# Altium project DAL_PDU.PrjPcb
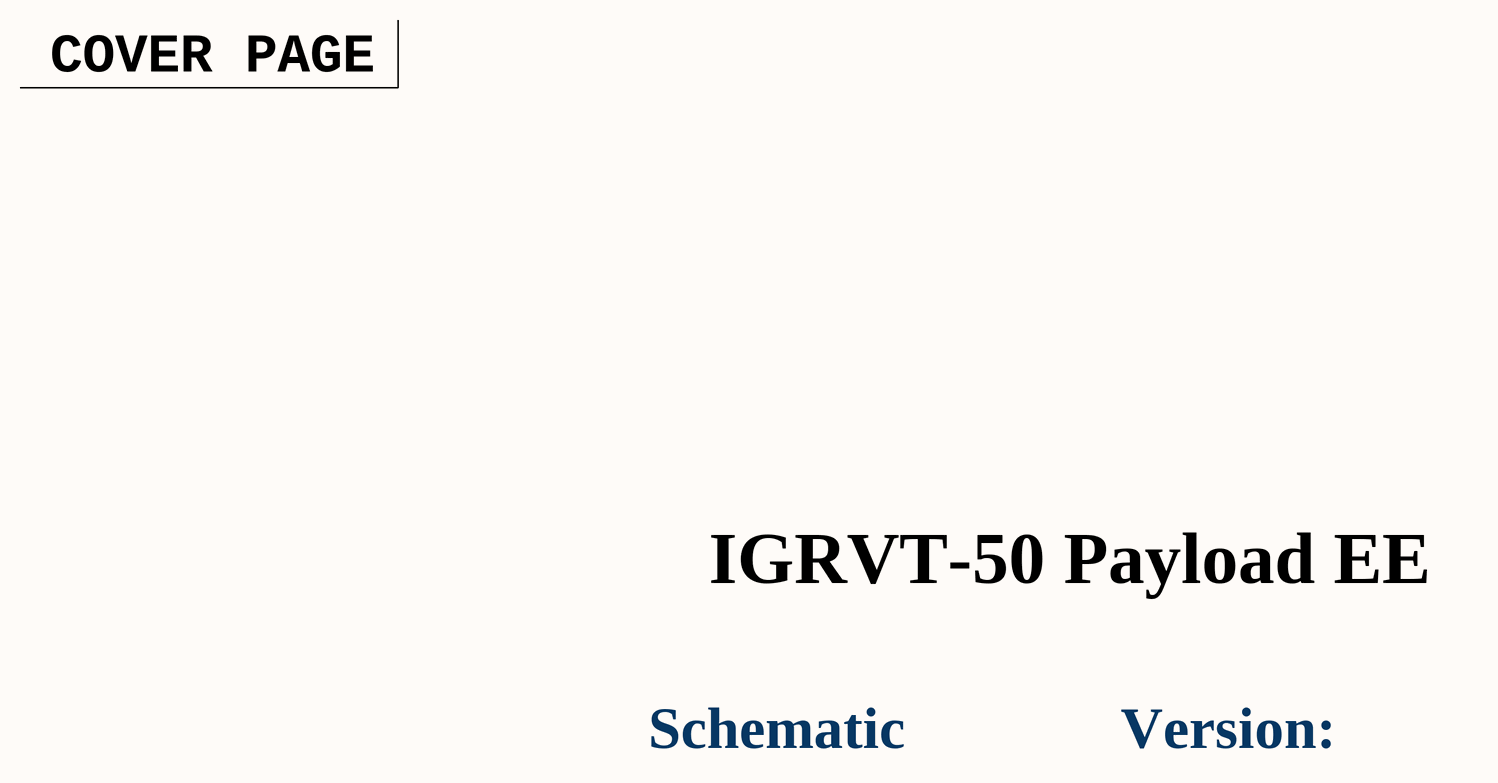
[diagram p0: CoverPage.SchDoc]
15 sheets, 248 parts. Net scope: global (net labels, ports and power ports of the same name join across sheets).
Board file: DAL_DPU.PcbDoc
Sheets:
  CoverPage.SchDoc
  Connectors.SchDoc
  PowerMonitor.SchDoc
  eFuse.SchDoc
  Buck 5V.SchDoc
  Buck 5-12V.SchDoc
  MCU.SchDoc
  CAN.SchDoc
  RS485.SchDoc
  TemperatureSensor.SchDoc
  RS232.SchDoc
  WatchDog.SchDoc
  I2C.SchDoc
  LED.SchDoc
  Mounting Holes.SchDoc

## Sheet CoverPage.SchDoc
size 420 x 297 mm; Revision: 1.1.0; SheetNumber: 1; SheetTotal: 15

### Notes on the sheet
- COVER PAGE
- IGRVT-50 Payload EE
- Schematic
- Version:
- Project:
- DAL_PDU
- Sub-system:
- IGRVT-50
- Design by:
- KIEN HOANG
- BAO BUI
- Sheet title:
- Sheet
- A3
- of
- Checked by:
- Approved by:
- VU PHAM
- Revision:
- Document No:
- Size:
- Date:

## Sheet Connectors.SchDoc
size 420 x 297 mm; Revision: 1.1.0; SheetNumber: 2; SheetTotal: 15
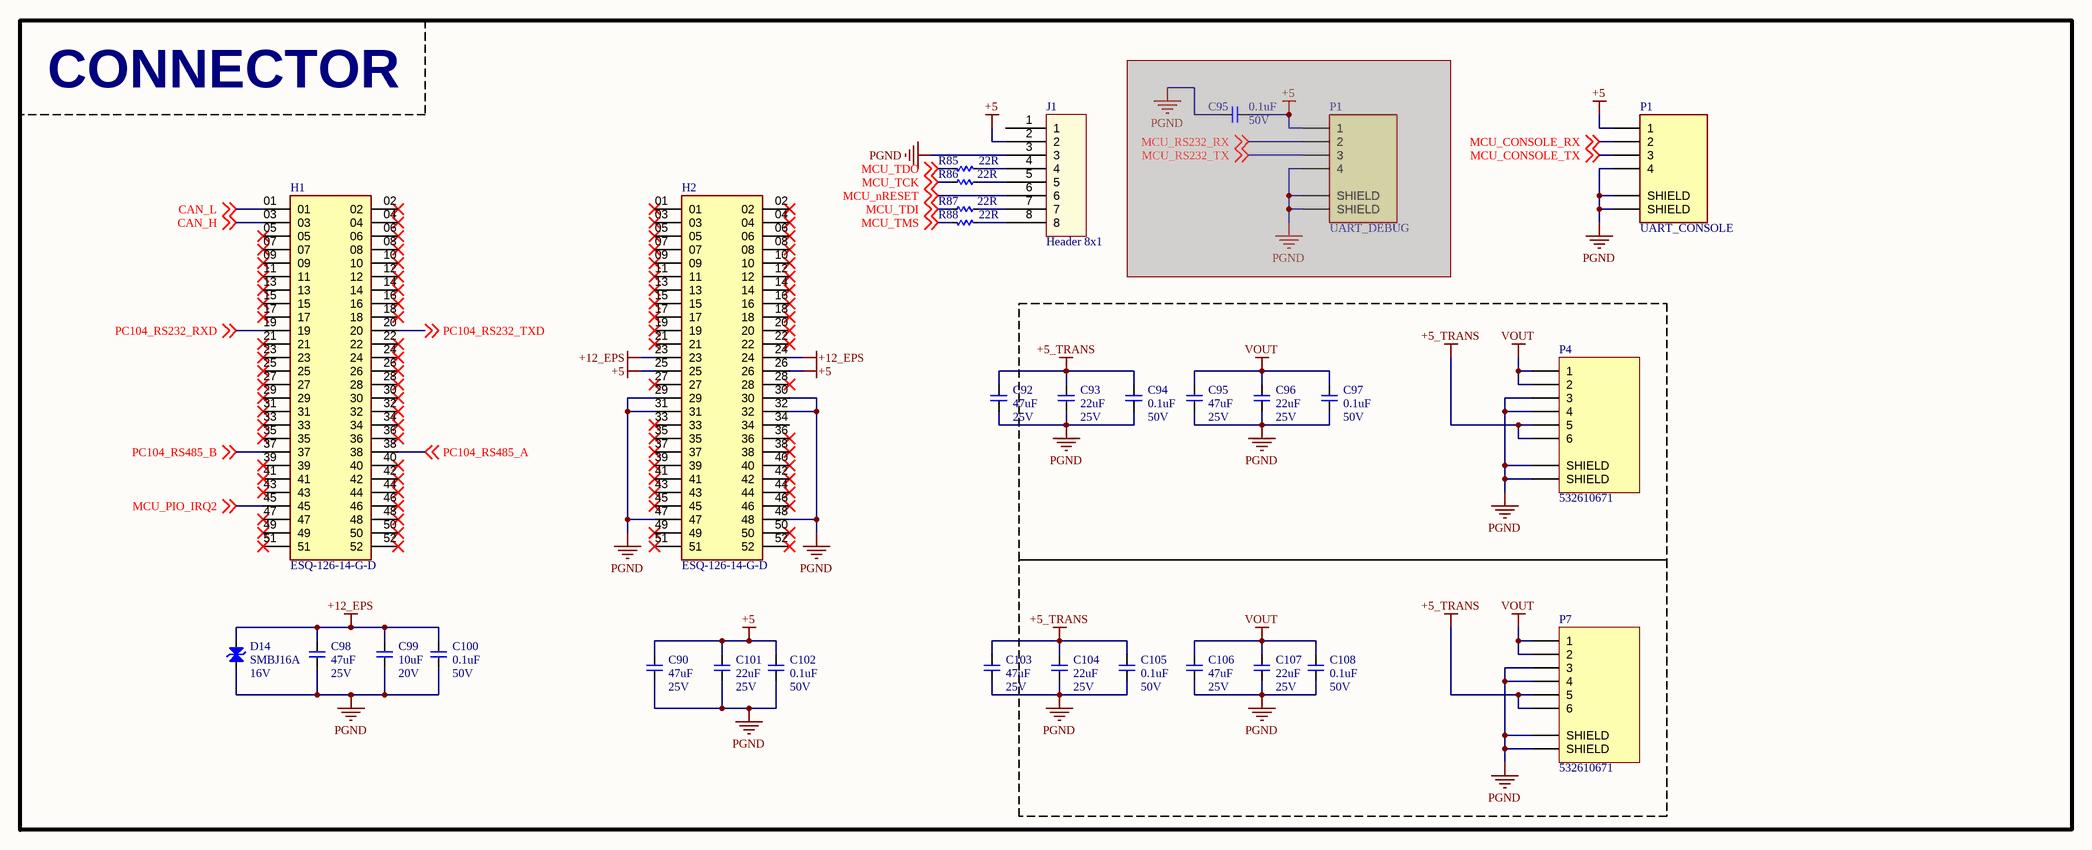
[diagram p1: Connectors.SchDoc]

### Parts
(Parts that share a designator on the sheet are numbered #1, #2 ... from top to bottom, then left to right.)
C90  47uF  Voltage: 25V  [CAP_C_3225X80]
C92  47uF  Voltage: 25V  [CAP_C_3225X80]
C93  22uF  Voltage: 25V  [CAP_C_2012X110]
C94  0.1uF  Voltage: 50V  [CAP_C_1608X80]
C95#1  0.1uF  Voltage: 50V  [CAP_C_1608X80]  (masked out: inside a compile mask, not in the netlist)
C95#2  47uF  Voltage: 25V  [CAP_C_3225X80]
C96  22uF  Voltage: 25V  [CAP_C_2012X110]
C97  0.1uF  Voltage: 50V  [CAP_C_1608X80]
C98  47uF  Voltage: 25V  [CAP_C_3225X80]
C99  10uF  Voltage: 20V  [CAP_C_2012X110]
C100  0.1uF  Voltage: 50V  [CAP_C_1608X80]
C101  22uF  Voltage: 25V  [CAP_C_2012X110]
C102  0.1uF  Voltage: 50V  [CAP_C_1608X80]
C103  47uF  Voltage: 25V  [CAP_C_3225X80]
C104  22uF  Voltage: 25V  [CAP_C_2012X110]
C105  0.1uF  Voltage: 50V  [CAP_C_1608X80]
C106  47uF  Voltage: 25V  [CAP_C_3225X80]
C107  22uF  Voltage: 25V  [CAP_C_2012X110]
C108  0.1uF  Voltage: 50V  [CAP_C_1608X80]
D14  SMBJ16A  Voltage: 16V  [DO-214AA_SMB]
H1  ESQ-126-14-G-D  [ESQ-126-14-G-D]
H2  ESQ-126-14-G-D  [ESQ-126-14-G-D]
J1  Header 8x1  [Header_254P_8x1]
P1#1  UART_DEBUG  [0532610471]  (masked out: inside a compile mask, not in the netlist)
P1#2  UART_CONSOLE  [0532610471]
P4  532610671  [532610671]
P7  532610671  [532610671]
R85  22R  [RES_C_1608X60]
R86  22R  [RES_C_1608X60]
R87  22R  [RES_C_1608X60]
R88  22R  [RES_C_1608X60]

### Blocks framed on the sheet
CONNECTOR: C90 C92-C94 C95#1 C95#2 C96-C108 D14 H1 H2 J1 P1#1 P1#2 P4 P7 R85-R88

### Nets
+5: C90.2 C101.2 C102.2 H2.25 H2.26 J1.2 P1#2.1
+5_TRANS: C92.2 C93.2 C94.2 C103.2 C104.2 C105.2 P4.5 P4.6 P7.5 P7.6
+12_EPS: C98.2 C99.2 C100.2 D14.1(A) H2.23 H2.24
PGND: C90.1 C92.1 C93.1 C94.1 C95#2.1 C96.1 C97.1 C98.1 C99.1 C100.1 C101.1 C102.1 C103.1 C104.1 C105.1 C106.1 C107.1 C108.1 D14.2(K) H2.29 H2.30 H2.31 H2.32 H2.47 H2.48 J1.3 P1#2.4 P1#2.S1(SHIELD) P1#2.S2(SHIELD) P4.3 P4.4 P4.S1(SHIELD) P4.S2(SHIELD) P7.3 P7.4 P7.S1(SHIELD) P7.S2(SHIELD)
VOUT: C95#2.2 C96.2 C97.2 C106.2 C107.2 C108.2 P4.1 P4.2 P7.1 P7.2
CAN_H: H1.03 ; off-sheet CAN_H
CAN_L: H1.01 ; off-sheet CAN_L
MCU_CONSOLE_RX: P1#2.2 ; off-sheet MCU_CONSOLE_RX
MCU_CONSOLE_TX: P1#2.3 ; off-sheet MCU_CONSOLE_TX
MCU_nRESET: J1.6 ; off-sheet MCU_nRESET
MCU_PIO_IRQ2: H1.45 ; off-sheet MCU_PIO_IRQ2
MCU_TCK: R86.1 ; off-sheet MCU_TCK
MCU_TDI: R87.1 ; off-sheet MCU_TDI
MCU_TDO: R85.2 ; off-sheet MCU_TDO
MCU_TMS: R88.1 ; off-sheet MCU_TMS
PC104_RS232_RXD: H1.19 ; off-sheet PC104_RS232_RXD
PC104_RS232_TXD: H1.20 ; off-sheet PC104_RS232_TXD
PC104_RS485_A: H1.38 ; off-sheet PC104_RS485_A
PC104_RS485_B: H1.37 ; off-sheet PC104_RS485_B
NetJ1_4: J1.4 R85.1
NetJ1_5: J1.5 R86.2
NetJ1_7: J1.7 R87.2
NetJ1_8: J1.8 R88.2

Not connected (* = marked no-connect by the designer): H1 02* 04* 05* 06* 07* 08* 09* 10* 11* 12* 13* 14* 15* 16* 17* 18* 21* 22* 23* 24* 25* 26* 27* 28* 29* 30* 31* 32* 33* 34* 35* 36* 39* 40* 41* 42* 43* 44* 46* 47* 48* 49* 50* 51* 52*; H2 01* 02* 03* 04* 05* 06* 07* 08* 09* 10* 11* 12* 13* 14* 15* 16* 17* 18* 19* 20* 21* 22* 27* 28* 33* 34 35* 36* 37* 38* 39* 40* 41* 42* 43* 44* 45* 46* 49* 50* 51* 52*; J1 1

### Notes on the sheet
- Project:
- DAL_PDU
- Sub-system:
- IGRVT-50
- Design by:
- KIEN HOANG
- BAO BUI
- Sheet title:
- Sheet
- A3
- of
- Checked by:
- Approved by:
- VU PHAM
- Revision:
- Document No:
- Size:
- Date:

### Library data of the parts
C90 C92-C94 C95#1 C95#2 C96-C108 = _CAP_C_2: CAP
D14 = Diode TVS: TVS Diode; Code - JEDEC: DO-214-AB; Value: 1N5007; Published: 8-Jun-2000; Revision: July-2002: Re-released for DXP Platform.; Publisher: Altium Limited
P1#1 P1#2 = 0532610471
R85-R88 = _RES_B_2_2: RES

## Sheet PowerMonitor.SchDoc
size 420 x 297 mm; Revision: 1.1.0; SheetNumber: 3; SheetTotal: 15
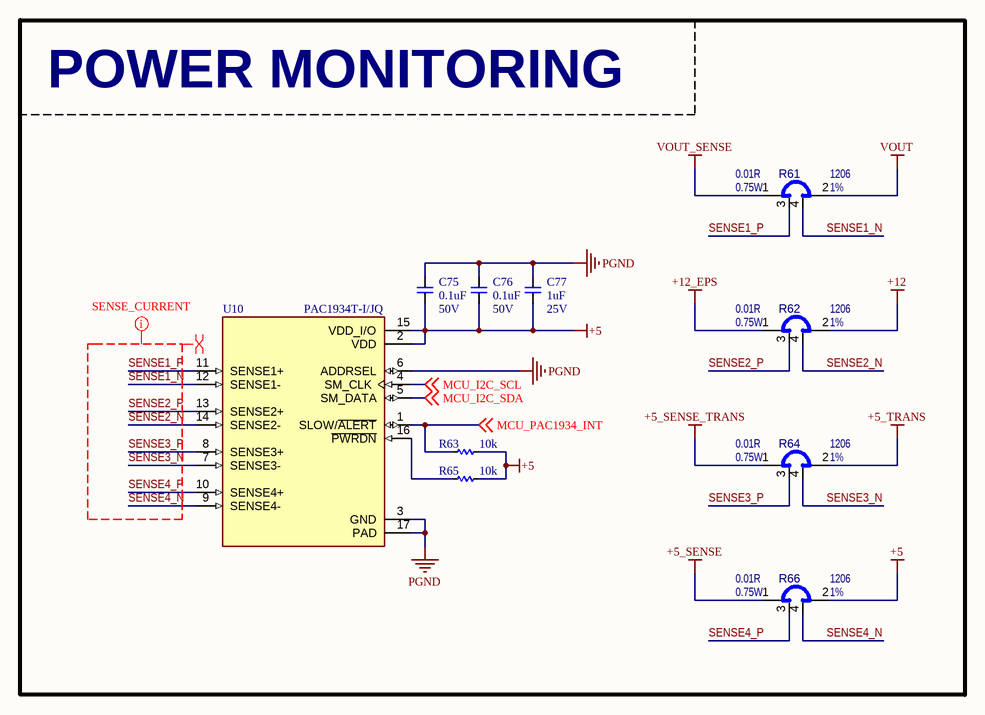
[diagram p2: PowerMonitor.SchDoc]

### Parts
C75  0.1uF  Voltage: 50V  [CAP_C_1608X80]
C76  0.1uF  Voltage: 50V  [CAP_C_1608X80]
C77  1uF  Voltage: 25V  [CAP_C_1608X80]
R61  value 0.01R  Package: 1206  Tolerance: 1%  Power: 0.75W  [RES_C_1206_SHUNT]  (hidden comment: Shunt 4 Pin)
R62  value 0.01R  Package: 1206  Tolerance: 1%  Power: 0.75W  [RES_C_1206_SHUNT]  (hidden comment: Shunt 4 Pin)
R63  10k  [RES_C_1608X60]
R64  value 0.01R  Package: 1206  Tolerance: 1%  Power: 0.75W  [RES_C_1206_SHUNT]  (hidden comment: Shunt 4 Pin)
R65  10k  [RES_C_1608X60]
R66  value 0.01R  Package: 1206  Tolerance: 1%  Power: 0.75W  [RES_C_1206_SHUNT]  (hidden comment: Shunt 4 Pin)
U10  PAC1934T-I/JQ  [QFN65]

### Blocks framed on the sheet
POWER MONITORING: C75-C77 R61-R66 U10

### Nets
+5: C75.2 C76.2 C77.2 R63.1 R65.2 R66.2 U10.2(VDD) U10.15(VDD_I/O)
+5_SENSE: R66.1
+5_SENSE_TRANS: R64.1
+5_TRANS: R64.2
+12: R62.2
+12_EPS: R62.1
PGND: C75.1 C76.1 C77.1 U10.3(GND) U10.6(ADDRSEL) U10.17(PAD)
VOUT: R61.2
VOUT_SENSE: R61.1
MCU_I2C_SCL: U10.4(SM_CLK) ; off-sheet MCU_I2C_SCL
MCU_I2C_SDA: U10.5(SM_DATA) ; off-sheet MCU_I2C_SDA
MCU_PAC1934_INT: R63.2 U10.1(SLOW/~{ALERT}) ; off-sheet MCU_PAC1934_INT
SENSE1_N: R61.4 U10.12(SENSE1-)
SENSE1_P: R61.3 U10.11(SENSE1+)
SENSE2_N: R62.4 U10.14(SENSE2-)
SENSE2_P: R62.3 U10.13(SENSE2+)
SENSE3_N: R64.4 U10.7(SENSE3-)
SENSE3_P: R64.3 U10.8(SENSE3+)
SENSE4_N: R66.4 U10.9(SENSE4-)
SENSE4_P: R66.3 U10.10(SENSE4+)
NetR65_1: R65.1 U10.16(~{PWRDN})

### Layout directives
differential pair: SENSE1_N, SENSE1_P, SENSE2_N, SENSE2_P, SENSE3_N, SENSE3_P, SENSE4_N, SENSE4_P
net class SENSE_CURRENT: SENSE1_N, SENSE1_P, SENSE2_N, SENSE2_P, SENSE3_N, SENSE3_P, SENSE4_N, SENSE4_P

### Notes on the sheet
- Project:
- DAL_PDU
- Sub-system:
- IGRVT-50
- Design by:
- KIEN HOANG
- BAO BUI
- Sheet title:
- Sheet
- A3
- of
- Checked by:
- Approved by:
- VU PHAM
- Revision:
- Document No:
- Size:
- Date:

### Library data of the parts
C75-C77 = _CAP_C_2: CAP
R61 R62 R64 R66 = RSMT1316: Shunt; Manufacturer 1: SUSUMU; Manufacturer Part Number 1: KRL1632E-M-R010-F-T5; Description_: RES SHUNT MF 0.01R 1% 0.75W SMD 1206; Dev Tools Status: Design; Temperature Coeffcient: 50ppm/C; Current: 8A; Owner: Ciprian Abramov; Populated: YES; MCHP-ID: RSMT1316; Revision: 1; Symbol: Shunt 4 Pin; Status: MCL Design; ComponentLink1URL: https://chn-vm-apps.microchip.com/mchprepo/parts/Datasheets/n_catalog_partition09_en.pdf; ComponentLink1Description: SVN Datasheet; ComponentLink2URL: C:\ALTIUM_WORK\00001_MCHP-CDB\Datasheets\n_catalog_partition09_en.pdf; ComponentLink2Description: Local Datasheet; ComponentLink3URL: C:\ALTIUM_WORK\00001_MCHP-CDB\Library\LibraryRefs\Shunt 4 Pin.SchLib; ComponentLink3Description: Open Symbol; ComponentLink4URL: C:\ALTIUM_WORK\00001_MCHP-CDB\Library\Footprints\RES_C_1206_SHUNT.PcbLib; ComponentLink4Description: Open Footprint; ComponentLink5Description: Open Footprint 2; ComponentLink6Description: Open Footprint 3; ComponentLink7Description: Open Footprint 4; Operating Temperature: -55C to +155C; Category: Resistor; Type: RES SMD; Composition: MF; Supplier 1: Digi-Key; Supplier Part Number 1: 408-1570-1-ND; Quantity Override: 1
R63 R65 = _RES_B_2_2: RES

## Sheet eFuse.SchDoc
size 420 x 297 mm; Revision: 1.1.0; SheetNumber: 4; SheetTotal: 15
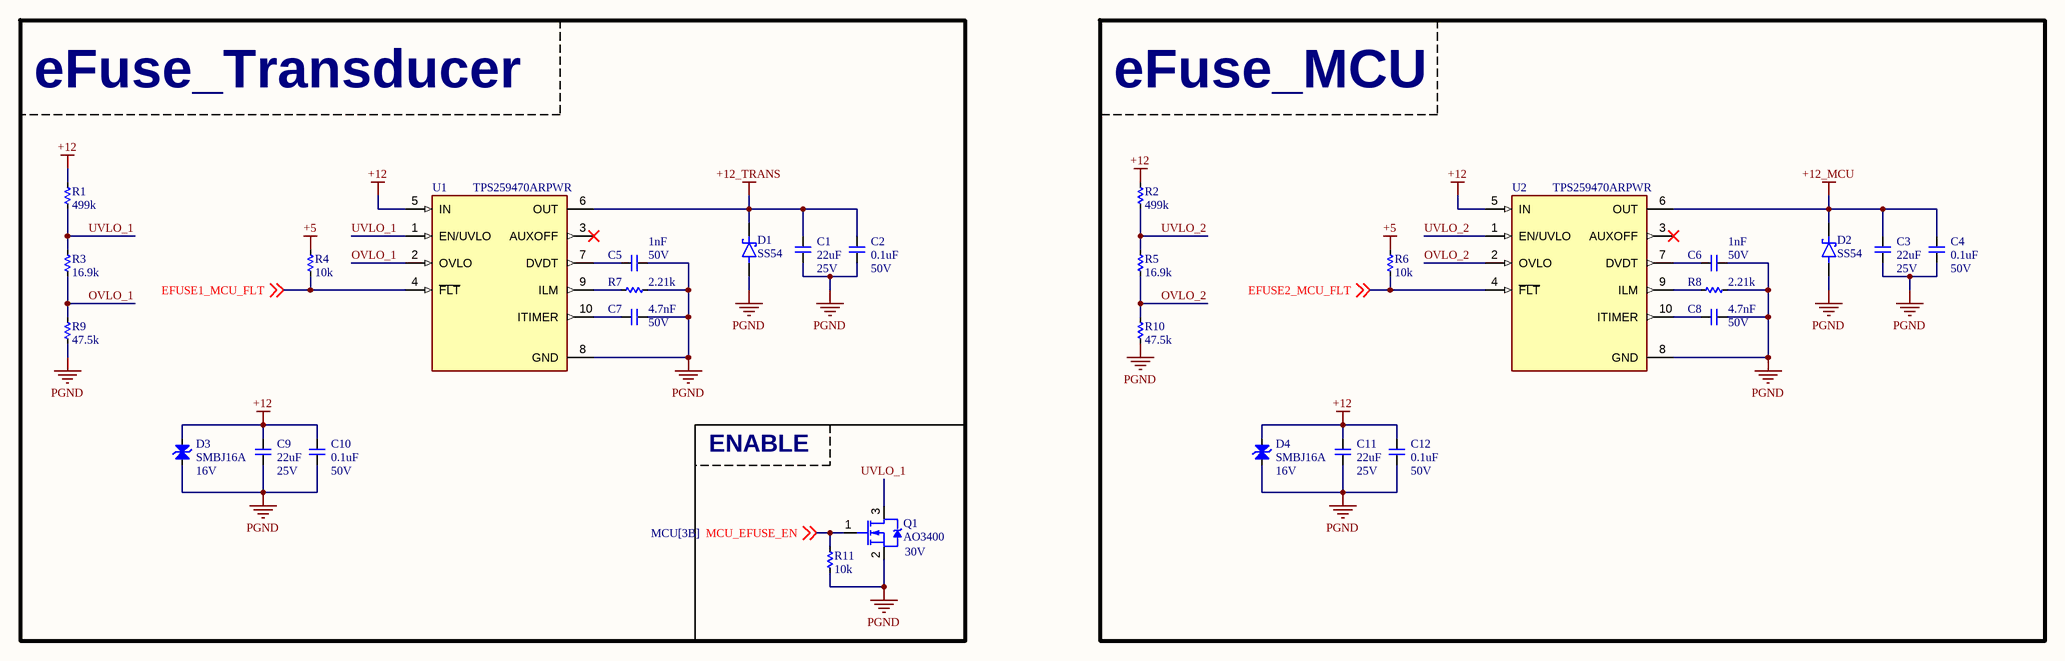
[diagram p3: eFuse.SchDoc]

### Parts
C1  22uF  Voltage: 25V  [CAP_C_2012X110]
C2  0.1uF  Voltage: 50V  [CAP_C_1608X80]
C3  22uF  Voltage: 25V  [CAP_C_2012X110]
C4  0.1uF  Voltage: 50V  [CAP_C_1608X80]
C5  1nF  Voltage: 50V  [CAP_C_1608X80]
C6  1nF  Voltage: 50V  [CAP_C_1608X80]
C7  4.7nF  Voltage: 50V  [CAP_C_1608X80]
C8  4.7nF  Voltage: 50V  [CAP_C_1608X80]
C9  22uF  Voltage: 25V  [CAP_C_2012X110]
C10  0.1uF  Voltage: 50V  [CAP_C_1608X80]
C11  22uF  Voltage: 25V  [CAP_C_2012X110]
C12  0.1uF  Voltage: 50V  [CAP_C_1608X80]
D1  SS54  [DO-214AC_SMA]
D2  SS54  [DO-214AC_SMA]
D3  SMBJ16A  Voltage: 16V  [DO-214AA_SMB]
D4  SMBJ16A  Voltage: 16V  [DO-214AA_SMB]
Q1  AO3400  Voltage: 30V  [SOT-23]
R1  499k  [RES_C_1608X60]
R2  499k  [RES_C_1608X60]
R3  16.9k  [RES_C_1608X60]
R4  10k  [RES_C_1608X60]
R5  16.9k  [RES_C_1608X60]
R6  10k  [RES_C_1608X60]
R7  2.21k  [RES_C_1608X60]
R8  2.21k  [RES_C_1608X60]
R9  47.5k  [RES_C_1608X60]
R10  47.5k  [RES_C_1608X60]
R11  10k  [RES_C_1608X60]
U1  TPS259470ARPWR  [TPS259474]
U2  TPS259470ARPWR  [TPS259474]

### Blocks framed on the sheet
eFuse_Transducer: C1 C2 C5 C7 C9 C10 D1 D3 Q1 R1 R3 R4 R7 R9 R11 U1
eFuse_MCU: C3 C4 C6 C8 C11 C12 D2 D4 R2 R5 R6 R8 R10 U2

### Nets
+5: R4.1 R6.1
+12: C9.2 C10.2 C11.2 C12.2 D3.1(A) D4.1(A) R1.2 R2.2 U1.5(IN) U2.5(IN)
+12_MCU: C3.2 C4.1 D2.1(K) U2.6(OUT)
+12_TRANS: C1.2 C2.1 D1.1(K) U1.6(OUT)
PGND: C1.1 C2.2 C3.1 C4.2 C5.2 C6.2 C7.2 C8.2 C9.1 C10.1 C11.1 C12.1 D1.2(A) D2.2(A) D3.2(K) D4.2(K) Q1.2(S) R7.2 R8.2 R9.1 R10.1 R11.2 U1.8(GND) U2.8(GND)
EFUSE1_MCU_FLT: R4.2 U1.4(~{FLT}) ; off-sheet EFUSE1_MCU_FLT
EFUSE2_MCU_FLT: R6.2 U2.4(~{FLT}) ; off-sheet EFUSE2_MCU_FLT
MCU_EFUSE_EN: Q1.1(G) R11.1 ; off-sheet MCU_EFUSE_EN
OVLO_1: R3.1 R9.2 U1.2(OVLO)
OVLO_2: R5.1 R10.2 U2.2(OVLO)
UVLO_1: Q1.3(D) R1.1 R3.2 U1.1(EN/UVLO)
UVLO_2: R2.1 R5.2 U2.1(EN/UVLO)
NetC5_1: C5.1 U1.7(DVDT)
NetC6_1: C6.1 U2.7(DVDT)
NetC7_1: C7.1 U1.10(ITIMER)
NetC8_1: C8.1 U2.10(ITIMER)
NetR7_1: R7.1 U1.9(ILM)
NetR8_1: R8.1 U2.9(ILM)

Not connected (* = marked no-connect by the designer): U1 3(AUXOFF)*; U2 3(AUXOFF)*

### Notes on the sheet
- ENABLE
- Project:
- DAL_PDU
- Sub-system:
- IGRVT-50
- Design by:
- KIEN HOANG
- BAO BUI
- Sheet title:
- Sheet
- A3
- of
- Checked by:
- Approved by:
- VU PHAM
- Revision:
- Document No:
- Size:
- Date:

### Library data of the parts
C1-C12 = _CAP_C_2: CAP
D1 D2 = DIODE SCHOTTKY
D3 D4 = Diode TVS: as D14 on sheet Connectors; Published: 8-Jun-2000; Revision: July-2002: Re-released for DXP Platform.; Publisher: Altium Limited
Q1 = Mosfet N
R1-R11 = _RES_B_2_2: RES

## Sheet Buck 5V.SchDoc
size 420 x 297 mm; Revision: 1.0.0; SheetNumber: 5; SheetTotal: 15
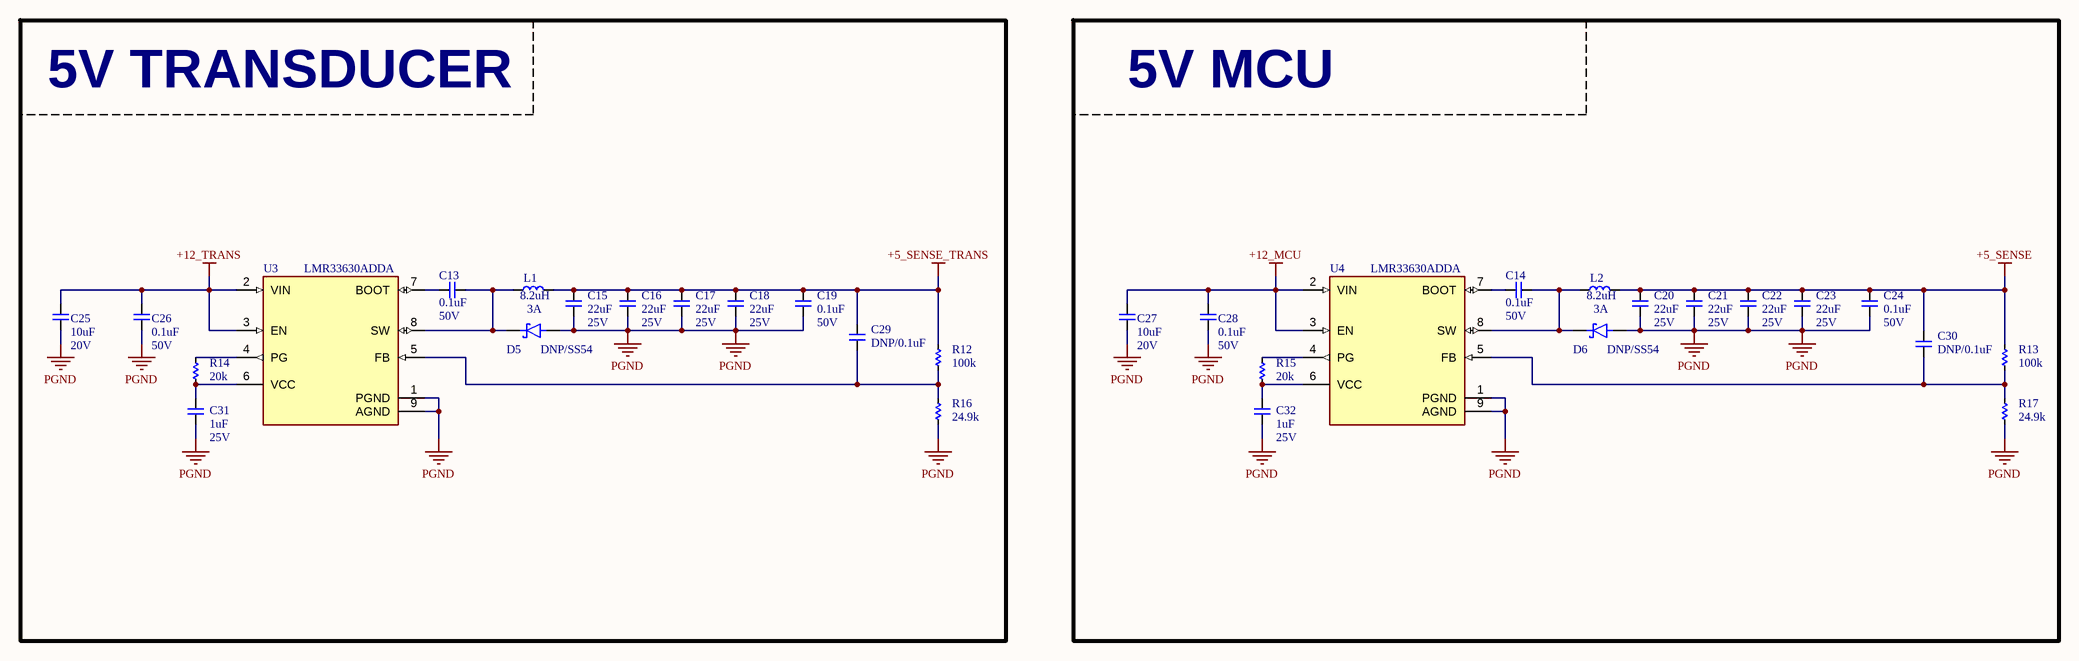
[diagram p4: Buck 5V.SchDoc]

### Parts
C13  0.1uF  Voltage: 50V  [CAP_C_1608X80]
C14  0.1uF  Voltage: 50V  [CAP_C_1608X80]
C15  22uF  Voltage: 25V  [CAP_C_2012X110]
C16  22uF  Voltage: 25V  [CAP_C_2012X110]
C17  22uF  Voltage: 25V  [CAP_C_2012X110]
C18  22uF  Voltage: 25V  [CAP_C_2012X110]
C19  0.1uF  Voltage: 50V  [CAP_C_1608X80]
C20  22uF  Voltage: 25V  [CAP_C_2012X110]
C21  22uF  Voltage: 25V  [CAP_C_2012X110]
C22  22uF  Voltage: 25V  [CAP_C_2012X110]
C23  22uF  Voltage: 25V  [CAP_C_2012X110]
C24  0.1uF  Voltage: 50V  [CAP_C_1608X80]
C25  10uF  Voltage: 20V  [CAP_C_2012X110]
C26  0.1uF  Voltage: 50V  [CAP_C_1608X80]
C27  10uF  Voltage: 20V  [CAP_C_2012X110]
C28  0.1uF  Voltage: 50V  [CAP_C_1608X80]
C29  Voltage: DNP/0.1uF  [CAP_C_1608X80]  (hidden comment: DNP/100nF)
C30  Voltage: DNP/0.1uF  [CAP_C_1608X80]  (hidden comment: DNP/100nF)
C31  1uF  Voltage: 25V  [CAP_C_1608X80]
C32  1uF  Voltage: 25V  [CAP_C_1608X80]
D5  DNP/SS54  [DO-214AC_SMA]
D6  DNP/SS54  [DO-214AC_SMA]
L1  8.2uH  Voltage: 3A  [INDUCTOR 6363]
L2  8.2uH  Voltage: 3A  [INDUCTOR 6363]
R12  100k  [RES_C_1608X60]
R13  100k  [RES_C_1608X60]
R14  20k  [RES_C_1608X60]
R15  20k  [RES_C_1608X60]
R16  24.9k  [RES_C_1608X60]
R17  24.9k  [RES_C_1608X60]
U3  LMR33630ADDA  [HSOIC_8]
U4  LMR33630ADDA  [HSOIC_8]

### Blocks framed on the sheet
5V TRANSDUCER: C13 C15-C19 C25 C26 C29 C31 D5 L1 R12 R14 R16 U3
5V MCU: C14 C20-C24 C27 C28 C30 C32 D6 L2 R13 R15 R17 U4

### Nets
+5_SENSE: C20.1 C21.1 C22.1 C23.1 C24.1 C30.1 L2.2 R13.1
+5_SENSE_TRANS: C15.1 C16.1 C17.1 C18.1 C19.1 C29.1 L1.2 R12.1
+12_MCU: C27.1 C28.1 U4.2(VIN) U4.3(EN)
+12_TRANS: C25.1 C26.1 U3.2(VIN) U3.3(EN)
PGND: C15.2 C16.2 C17.2 C18.2 C19.2 C20.2 C21.2 C22.2 C23.2 C24.2 C25.2 C26.2 C27.2 C28.2 C31.2 C32.2 D5.2(A) D6.2(A) R16.2 R17.2 U3.1(PGND) U3.9(AGND) U4.1(PGND) U4.9(AGND)
NetC13_1: C13.1 D5.1(K) L1.1 U3.8(SW)
NetC13_2: C13.2 U3.7(BOOT)
NetC14_1: C14.1 D6.1(K) L2.1 U4.8(SW)
NetC14_2: C14.2 U4.7(BOOT)
NetC29_2: C29.2 R12.2 R16.1 U3.5(FB)
NetC30_2: C30.2 R13.2 R17.1 U4.5(FB)
NetC31_1: C31.1 R14.2 U3.6(VCC)
NetC32_1: C32.1 R15.2 U4.6(VCC)
NetR14_1: R14.1 U3.4(PG)
NetR15_1: R15.1 U4.4(PG)

### Notes on the sheet
- Project:
- DAL_PDU
- Sub-system:
- IGRVT-50
- Design by:
- KIEN HOANG
- BAO BUI
- Sheet title:
- Sheet
- A3
- of
- Checked by:
- Approved by:
- VU PHAM
- Revision:
- Document No:
- Size:
- Date:

### Library data of the parts
C13-C32 = _CAP_C_2: CAP
D5 D6 = DIODE SCHOTTKY
L1 L2 = Inductor
R12-R17 = _RES_B_2_2: RES

## Sheet Buck 5-12V.SchDoc
size 420 x 297 mm; SheetNumber: 6; SheetTotal: 15
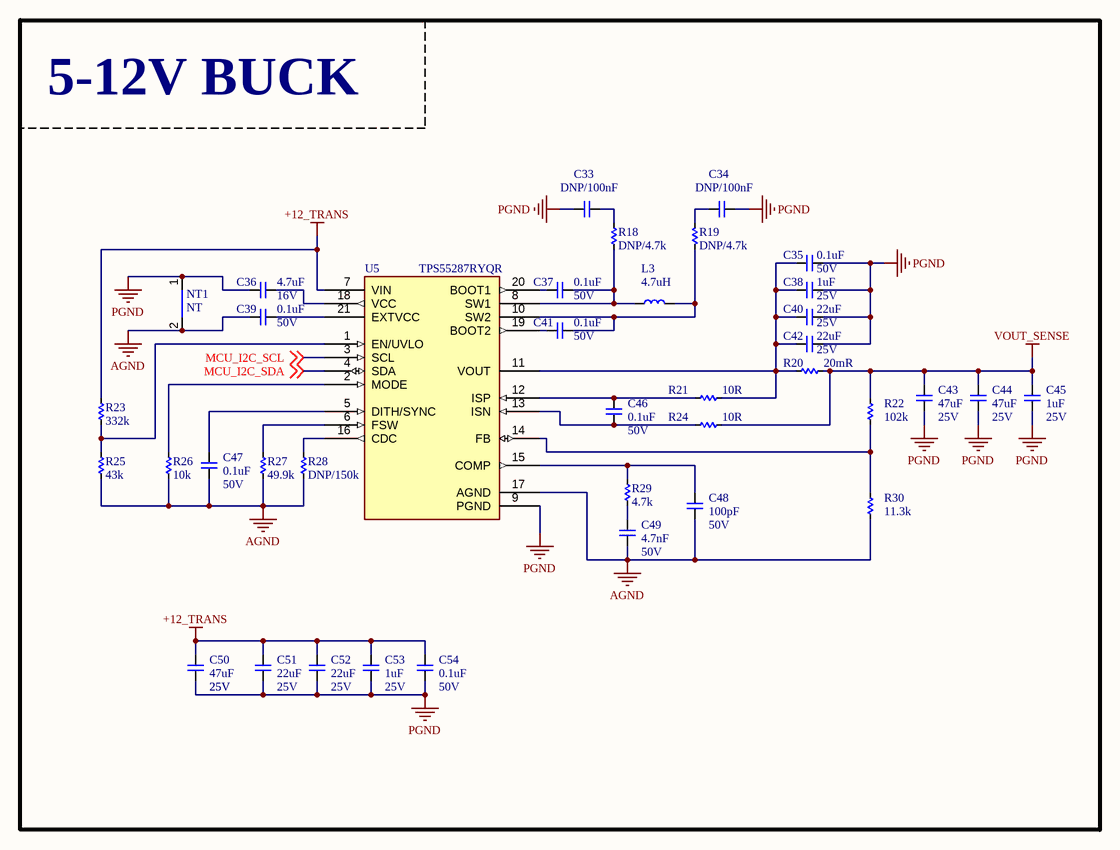
[diagram p5: Buck 5-12V.SchDoc]

### Parts
C33  DNP/100nF  [CAP_C_2012X110]
C34  DNP/100nF  [CAP_C_2012X110]
C35  0.1uF  Voltage: 50V  [CAP_C_1608X80]
C36  4.7uF  Voltage: 16V  [CAP_C_1608X80]
C37  0.1uF  Voltage: 50V  [CAP_C_1608X80]
C38  1uF  Voltage: 25V  [CAP_C_1608X80]
C39  0.1uF  Voltage: 50V  [CAP_C_1608X80]
C40  22uF  Voltage: 25V  [CAP_C_2012X110]
C41  0.1uF  Voltage: 50V  [CAP_C_1608X80]
C42  22uF  Voltage: 25V  [CAP_C_2012X110]
C43  47uF  Voltage: 25V  [CAP_C_3225X80]
C44  47uF  Voltage: 25V  [CAP_C_3225X80]
C45  1uF  Voltage: 25V  [CAP_C_1608X80]
C46  0.1uF  Voltage: 50V  [CAP_C_1608X80]
C47  0.1uF  Voltage: 50V  [CAP_C_1608X80]
C48  100pF  Voltage: 50V  [CAP_C_1608X80]
C49  4.7nF  Voltage: 50V  [CAP_C_1608X80]
C50  47uF  Voltage: 25V  [CAP_C_3225X80]
C51  22uF  Voltage: 25V  [CAP_C_2012X110]
C52  22uF  Voltage: 25V  [CAP_C_2012X110]
C53  1uF  Voltage: 25V  [CAP_C_1608X80]
C54  0.1uF  Voltage: 50V  [CAP_C_1608X80]
L3  4.7uH  [Inductor SMD 6x5.7x5]
NT1  NT  [NETTIE_SMD]  (net tie)
R18  DNP/4.7k  [RES_C_3216X70]
R19  DNP/4.7k  [RES_C_3216X70]
R20  20mR  [RES_C_3216X70]
R21  10R  [RES_C_1608X60]
R22  102k  [RES_C_1608X60]
R23  332k  [RES_C_1608X60]
R24  10R  [RES_C_1608X60]
R25  43k  [RES_C_1608X60]
R26  10k  [RES_C_1608X60]
R27  49.9k  [RES_C_1608X60]
R28  DNP/150k  [RES_C_1608X60]
R29  4.7k  [RES_C_1608X60]
R30  11.3k  [RES_C_1608X60]
U5  TPS55287RYQR  [VQFN_TPS]

### Nets
+12_TRANS: C50.2 C51.2 C52.2 C53.2 C54.2 R23.2 U5.7(VIN)
AGND: C39.1 C47.1 C48.1 C49.1 NT1.2 R25.2 R26.1 R27.1 R28.1 R30.1 U5.17(AGND)
PGND: C33.2 C34.2 C35.1 C36.1 C38.1 C40.1 C42.1 C43.1 C44.1 C45.1 C50.1 C51.1 C52.1 C53.1 C54.1 NT1.1 U5.9(PGND)
VOUT_SENSE: C43.2 C44.2 C45.2 R20.1 R22.2 R24.1
MCU_I2C_SCL: U5.3(SCL) ; off-sheet MCU_I2C_SCL
MCU_I2C_SDA: U5.4(SDA) ; off-sheet MCU_I2C_SDA
NetC33_1: C33.1 R18.1
NetC34_1: C34.1 R19.2
NetC35_2: C35.2 C38.2 C40.2 C42.2 R20.2 R21.1 U5.11(VOUT)
NetC36_2: C36.2 U5.18(VCC)
NetC37_1: C37.1 L3.1 R18.2 U5.8(SW1)
NetC37_2: C37.2 U5.20(BOOT1)
NetC39_2: C39.2 U5.21(EXTVCC)
NetC41_1: C41.1 L3.2 R19.1 U5.10(SW2)
NetC41_2: C41.2 U5.19(BOOT2)
NetC46_1: C46.1 R21.2 U5.12(ISP)
NetC46_2: C46.2 R24.2 U5.13(ISN)
NetC47_2: C47.2 U5.5(DITH/SYNC)
NetC48_2: C48.2 R29.2 U5.15(COMP)
NetC49_2: C49.2 R29.1
NetR22_1: R22.1 R30.2 U5.14(FB)
NetR23_1: R23.1 R25.1 U5.1(EN/UVLO)
NetR26_2: R26.2 U5.2(MODE)
NetR27_2: R27.2 U5.6(FSW)
NetR28_2: R28.2 U5.16(CDC)

### Notes on the sheet
- 5-12V BUCK
- (near C50) 25V
- Project:
- DAL_PDU
- Sub-system:
- IGRVT-50
- Design by:
- KIEN HOANG
- BAO BUI
- Sheet title:
- Sheet
- A3
- of
- Checked by:
- Approved by:
- VU PHAM
- Revision:
- Document No:
- Size:
- Date:

### Library data of the parts
C33-C54 = _CAP_C_2: CAP
L3 = Inductor
NT1 = NetTie_SMD: Net Tie SMD
R18-R30 = _RES_B_2_2: RES
U5 = TPS55289-Q1

## Sheet MCU.SchDoc
size 420 x 297 mm; SheetNumber: 7; SheetTotal: 15
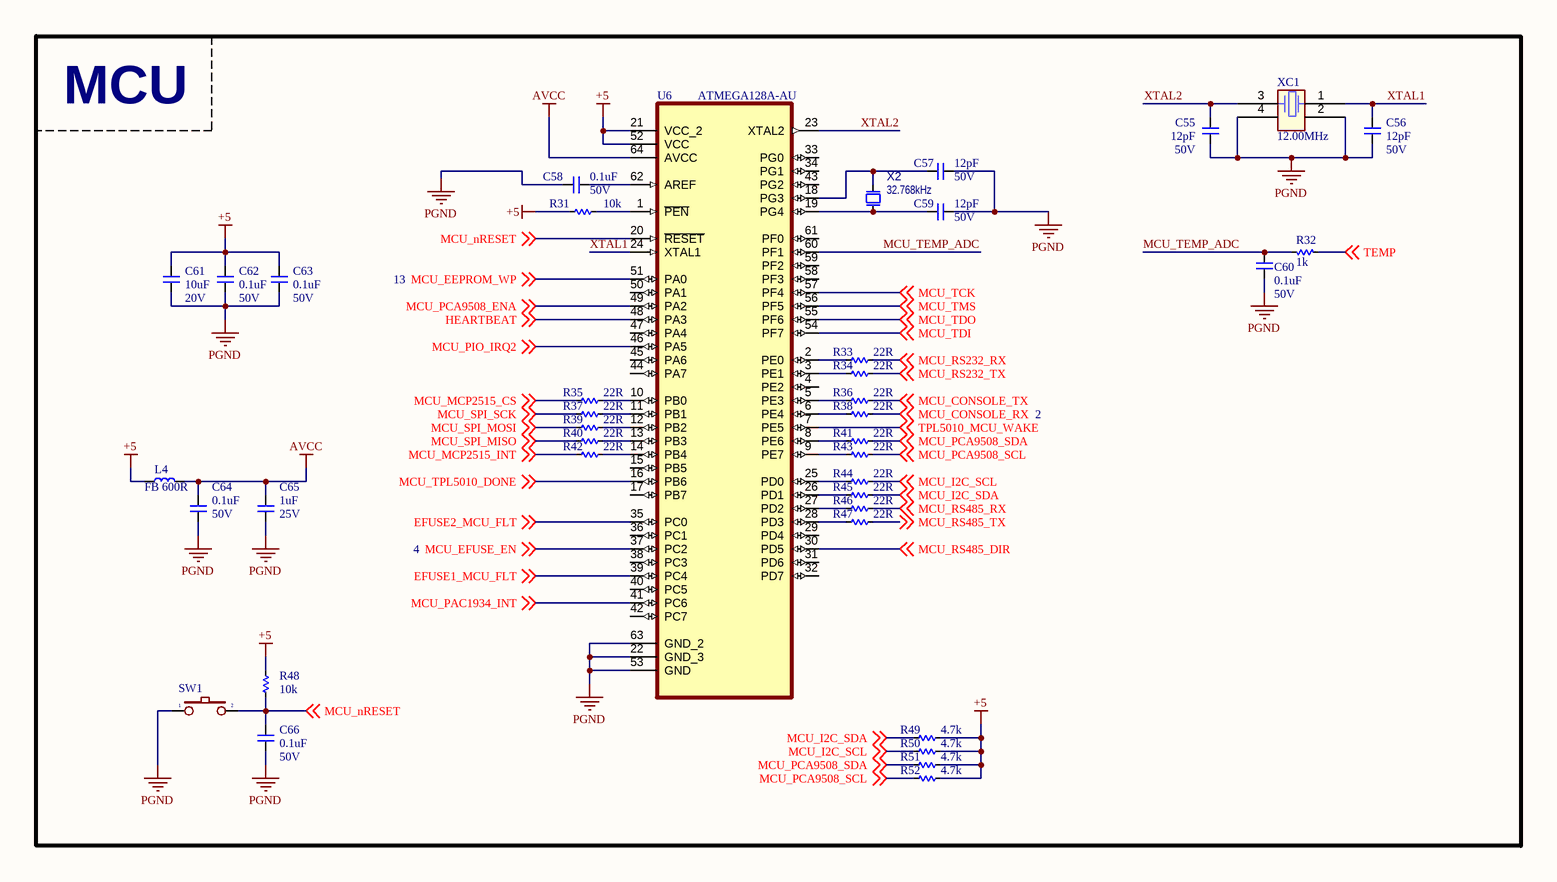
[diagram p6: MCU.SchDoc, left]
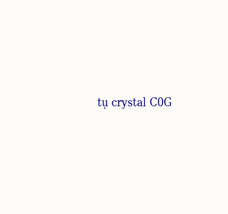
[diagram p7: MCU.SchDoc, right]

### Parts
C55  12pF  Voltage: 50V  [CAP_C_1608X80]
C56  12pF  Voltage: 50V  [CAP_C_1608X80]
C57  12pF  Voltage: 50V  [CAP_C_1608X80]
C58  0.1uF  Voltage: 50V  [CAP_C_1608X80]
C59  12pF  Voltage: 50V  [CAP_C_1608X80]
C60  0.1uF  Voltage: 50V  [CAP_C_1608X80]
C61  10uF  Voltage: 20V  [CAP_C_2012X110]
C62  0.1uF  Voltage: 50V  [CAP_C_1608X80]
C63  0.1uF  Voltage: 50V  [CAP_C_1608X80]
C64  0.1uF  Voltage: 50V  [CAP_C_1608X80]
C65  1uF  Voltage: 25V  [CAP_C_1608X80]
C66  0.1uF  Voltage: 50V  [CAP_C_1608X80]
L4  FB 600R  [L-SMD-0603]
R31  10k  [RES_C_1608X60]
R32  1k  [RES_C_1608X60]
R33  22R  [RES_C_1608X60]
R34  22R  [RES_C_1608X60]
R35  22R  [RES_C_1608X60]
R36  22R  [RES_C_1608X60]
R37  22R  [RES_C_1608X60]
R38  22R  [RES_C_1608X60]
R39  22R  [RES_C_1608X60]
R40  22R  [RES_C_1608X60]
R41  22R  [RES_C_1608X60]
R42  22R  [RES_C_1608X60]
R43  22R  [RES_C_1608X60]
R44  22R  [RES_C_1608X60]
R45  22R  [RES_C_1608X60]
R46  22R  [RES_C_1608X60]
R47  22R  [RES_C_1608X60]
R48  10k  [RES_C_1608X60]
R49  4.7k  [RES_C_1608X60]
R50  4.7k  [RES_C_1608X60]
R51  4.7k  [RES_C_1608X60]
R52  4.7k  [RES_C_1608X60]
SW1  SW2  [SW1-SMD]  (value not drawn)
U6  ATMEGA128A-AU  [TQFP-64]
X2  value 32.768kHz  [CRYSTAL_NX2012SA]  (hidden comment: Crystal 2 Pins)
XC1  value 12.00MHz  [AP7-00039]  (hidden comment: FC5BQCCMC12.0-T1)

### Blocks framed on the sheet
MCU: C55-C66 L4 R31-R52 SW1 U6 X2 XC1

### Nets
+5: C61.2 C62.1 C63.1 L4.1 R31.1 R48.1 R49.1 R50.1 R51.1 R52.1 U6.21(VCC_2) U6.52(VCC)
AVCC: C64.1 C65.1 L4.2 U6.64(AVCC)
PGND: C55.1 C56.1 C57.1 C58.2 C59.1 C60.2 C61.1 C62.2 C63.2 C64.2 C65.2 C66.1 SW1.1 U6.22(GND_3) U6.53(GND) U6.63(GND_2) XC1.2 XC1.4
EFUSE1_MCU_FLT: U6.39(PC4) ; off-sheet EFUSE1_MCU_FLT
EFUSE2_MCU_FLT: U6.35(PC0) ; off-sheet EFUSE2_MCU_FLT
HEARTBEAT: U6.48(PA3) ; off-sheet HEARTBEAT
MCU_CONSOLE_RX: R38.2 ; off-sheet MCU_CONSOLE_RX
MCU_CONSOLE_TX: R36.2 ; off-sheet MCU_CONSOLE_TX
MCU_EEPROM_WP: U6.51(PA0) ; off-sheet MCU_EEPROM_WP
MCU_EFUSE_EN: U6.37(PC2) ; off-sheet MCU_EFUSE_EN
MCU_I2C_SCL: R44.2 R50.2 ; off-sheet MCU_I2C_SCL
MCU_I2C_SDA: R45.2 R49.2 ; off-sheet MCU_I2C_SDA
MCU_MCP2515_CS: R35.1 ; off-sheet MCU_MCP2515_CS
MCU_MCP2515_INT: R42.1 ; off-sheet MCU_MCP2515_INT
MCU_nRESET: C66.2 R48.2 SW1.2 U6.20(~{RESET}) ; off-sheet MCU_nRESET
MCU_PAC1934_INT: U6.41(PC6) ; off-sheet MCU_PAC1934_INT
MCU_PCA9508_ENA: U6.49(PA2) ; off-sheet MCU_PCA9508_ENA
MCU_PCA9508_SCL: R43.2 R52.2 ; off-sheet MCU_PCA9508_SCL
MCU_PCA9508_SDA: R41.2 R51.2 ; off-sheet MCU_PCA9508_SDA
MCU_PIO_IRQ2: U6.46(PA5) ; off-sheet MCU_PIO_IRQ2
MCU_RS232_RX: R33.2 ; off-sheet MCU_RS232_RX
MCU_RS232_TX: R34.2 ; off-sheet MCU_RS232_TX
MCU_RS485_DIR: U6.30(PD5) ; off-sheet MCU_RS485_DIR
MCU_RS485_RX: R46.2 ; off-sheet MCU_RS485_RX
MCU_RS485_TX: R47.2 ; off-sheet MCU_RS485_TX
MCU_SPI_MISO: R40.1 ; off-sheet MCU_SPI_MISO
MCU_SPI_MOSI: R39.1 ; off-sheet MCU_SPI_MOSI
MCU_SPI_SCK: R37.1 ; off-sheet MCU_SPI_SCK
MCU_TCK: U6.57(PF4) ; off-sheet MCU_TCK
MCU_TDI: U6.54(PF7) ; off-sheet MCU_TDI
MCU_TDO: U6.55(PF6) ; off-sheet MCU_TDO
MCU_TEMP_ADC: C60.1 R32.2 U6.60(PF1)
MCU_TMS: U6.56(PF5) ; off-sheet MCU_TMS
MCU_TPL5010_DONE: U6.16(PB6) ; off-sheet MCU_TPL5010_DONE
TEMP: R32.1 ; off-sheet TEMP
TPL5010_MCU_WAKE: U6.7(PE5) ; off-sheet TPL5010_MCU_WAKE
XTAL1: C56.2 U6.24(XTAL1) XC1.1
XTAL2: C55.2 U6.23(XTAL2) XC1.3
NetC57_2: C57.2 U6.18(PG3) X2.2(Osc2)
NetC58_1: C58.1 U6.62(AREF)
NetC59_2: C59.2 U6.19(PG4) X2.1(Osc1)
NetR31_2: R31.2 U6.1(~{PEN})
NetR33_1: R33.1 U6.2(PE0)
NetR34_1: R34.1 U6.3(PE1)
NetR35_2: R35.2 U6.10(PB0)
NetR36_1: R36.1 U6.5(PE3)
NetR37_2: R37.2 U6.11(PB1)
NetR38_1: R38.1 U6.6(PE4)
NetR39_2: R39.2 U6.12(PB2)
NetR40_2: R40.2 U6.13(PB3)
NetR41_1: R41.1 U6.8(PE6)
NetR42_2: R42.2 U6.14(PB4)
NetR43_1: R43.1 U6.9(PE7)
NetR44_1: R44.1 U6.25(PD0)
NetR45_1: R45.1 U6.26(PD1)
NetR46_1: R46.1 U6.27(PD2)
NetR47_1: R47.1 U6.28(PD3)

Not connected (* = marked no-connect by the designer): U6 4(PE2) 15(PB5) 17(PB7) 29(PD4) 31(PD6) 32(PD7) 33(PG0) 34(PG1) 36(PC1) 38(PC3) 40(PC5) 42(PC7) 43(PG2) 44(PA7) 45(PA6) 47(PA4) 50(PA1) 58(PF3) 59(PF2) 61(PF0)

### Notes on the sheet
- tụ crystal C0G
- Project:
- DAL_PDU
- Sub-system:
- IGRVT-50
- Design by:
- KIEN HOANG
- BAO BUI
- Sheet title:
- Sheet
- A3
- of
- Checked by:
- Approved by:
- VU PHAM
- Revision:
- Document No:
- Size:
- Date:

### Library data of the parts
C55-C66 = _CAP_C_2: CAP
L4 = Inductor: Ferrite Bread
R31-R52 = _RES_B_2_2: RES
SW1 = SW2: Switch button 2 pin
X2 = OSC_32.768kHz: Crystal; Manufacturer 1: NDK; Manufacturer Part Number 1: NX2012SA-32.768K-STD-MUB-1; MCHP-ID: OSC1092; Description_: CRYSTAL 32.768kHz 12.5pF SMD NX2012SA; Dev Tools Status: Production; Owner: Jamus Griego; Tolerance: ±20ppm; Load Capacitance: 12.5pF; Populated: YES; Revision: 1; Symbol: Crystal 2 Pins; Status: MCL Design; ComponentLink1URL: https://chn-vm-apps.microchip.com/mchprepo/parts/Datasheets/c_NX2012SA-STD-MUB-1_e.pdf; ComponentLink1Description: SVN Datasheet; ComponentLink2URL: C:\ALTIUM_WORK\00001_MCHP-CDB\Datasheets\c_NX2012SA-STD-MUB-1_e.pdf; ComponentLink2Description: Local Datasheet; ComponentLink3URL: C:\ALTIUM_WORK\00001_MCHP-CDB\Library\LibraryRefs\Crystal 2 Pins.SchLib; ComponentLink3Description: Open Symbol; ComponentLink4URL: C:\ALTIUM_WORK\00001_MCHP-CDB\Library\Footprints\CRYSTAL_NX2012SA.PcbLib; ComponentLink4Description: Open Footprint; ComponentLink5Description: Open Footprint 2; ComponentLink6Description: Open Footprint 3; ComponentLink7Description: Open Footprint 4; Type: Crystal; Category: Crystal/Oscillator; Supplier 1: Digi-Key; Supplier Part Number 1: 644-1219-1-ND; Quantity Override: 1
XC1 = A07-0042: Fox FQ5032B 12.0MHz SMD crystal 738B-12; PartGroup: Frequency devices,Crystals,SMD; Manufacturer: Fox  Electronics; MPN: FQ5032B-12.000; Tolerance: Â±30ppm; TemperatureRange: 0Â°C ~ 70Â°C; AN: A07-0042; Height: 1,20000004768372

## Sheet CAN.SchDoc
size 420 x 297 mm; Revision: 1.1.0; SheetNumber: 8; SheetTotal: 15
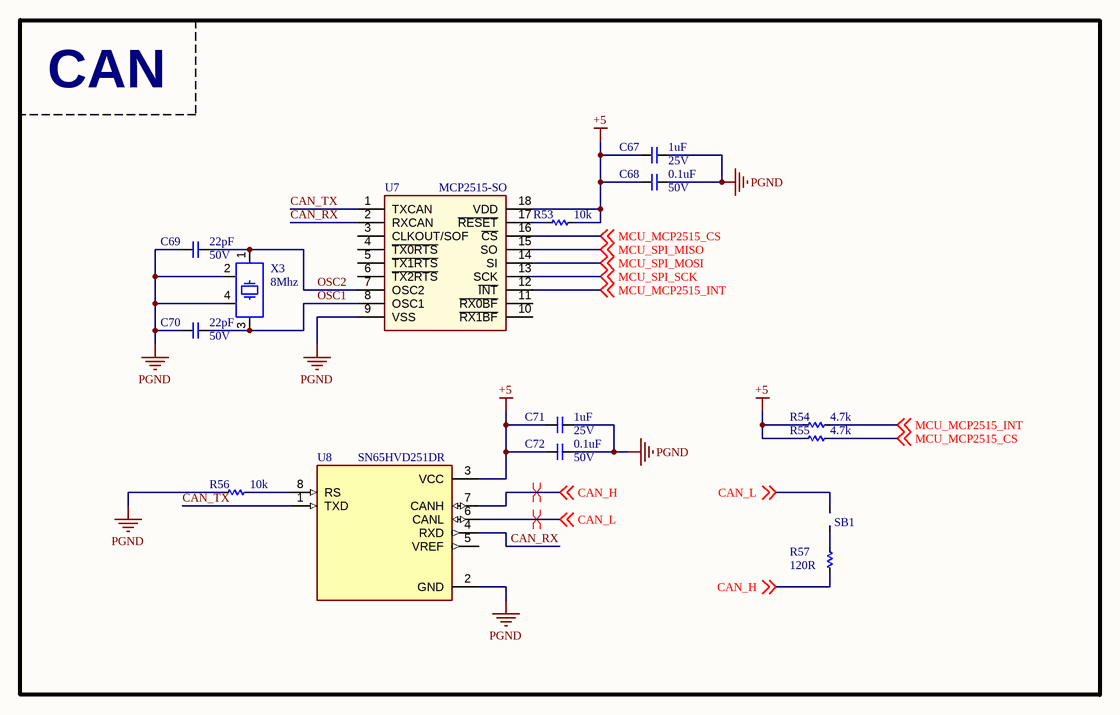
[diagram p8: CAN.SchDoc]

### Parts
C67  1uF  Voltage: 25V  [CAP_C_1608X80]
C68  0.1uF  Voltage: 50V  [CAP_C_1608X80]
C69  22pF  Voltage: 50V  [CAP_C_1608X80]
C70  22pF  Voltage: 50V  [CAP_C_1608X80]
C71  1uF  Voltage: 25V  [CAP_C_1608X80]
C72  0.1uF  Voltage: 50V  [CAP_C_1608X80]
R53  10k  [RES_C_1608X60]
R54  4.7k  [RES_C_1608X60]
R55  4.7k  [RES_C_1608X60]
R56  10k  [RES_C_1608X60]
R57  120R  [RES_C_1608X60]
SB1  N/A  [JUMPER_1608]  (value not drawn)
U7  MCP2515-SO  [SOIC-20]
U8  SN65HVD251DR  [SOIC-8]
X3  8Mhz  [XTAL_3225]

### Blocks framed on the sheet
CAN: C67-C72 R53-R57 SB1 U7 U8 X3

### Nets
+5: C67.1 C68.1 C71.2 C72.1 R53.2 R54.1 R55.1 U7.18(VDD) U8.3(VCC)
PGND: C67.2 C68.2 C69.2 C70.2 C71.1 C72.2 R56.1 U7.9(VSS) U8.2(GND) X3.2 X3.4
CAN_H: R57.1 U8.7(CANH) ; off-sheet CAN_H
CAN_L: SB1.1 U8.6(CANL) ; off-sheet CAN_L
CAN_RX: U7.2(RXCAN) U8.4(RXD)
CAN_TX: U7.1(TXCAN) U8.1(TXD)
MCU_MCP2515_CS: R55.2 U7.16(~{CS}) ; off-sheet MCU_MCP2515_CS
MCU_MCP2515_INT: R54.2 U7.12(~{INT}) ; off-sheet MCU_MCP2515_INT
MCU_SPI_MISO: U7.15(SO) ; off-sheet MCU_SPI_MISO
MCU_SPI_MOSI: U7.14(SI) ; off-sheet MCU_SPI_MOSI
MCU_SPI_SCK: U7.13(SCK) ; off-sheet MCU_SPI_SCK
OSC1: C70.1 U7.8(OSC1) X3.3
OSC2: C69.1 U7.7(OSC2) X3.1
NetR53_1: R53.1 U7.17(~{RESET})
NetR56_2: R56.2 U8.8(RS)
NetR57_2: R57.2 SB1.2

Not connected (* = marked no-connect by the designer): U7 3(CLKOUT/SOF) 4(~{TX0RTS}) 5(~{TX1RTS}) 6(~{TX2RTS}) 10(~{RX1BF}) 11(~{RX0BF}); U8 5(VREF)

### Layout directives
differential pair: CAN_H, CAN_L

### Notes on the sheet
- Project:
- DAL_PDU
- Sub-system:
- IGRVT-50
- Design by:
- KIEN HOANG
- BAO BUI
- Sheet title:
- Sheet
- A3
- of
- Checked by:
- Approved by:
- VU PHAM
- Revision:
- Document No:
- Size:
- Date:

### Library data of the parts
C67-C72 = _CAP_C_2: CAP
R53-R57 = _RES_B_2_2: RES
SB1 = JUMPER
U7 = MCP2515-SO: Stand-Alone CAN Controller with SPI Interface
X3 = crystal_4pin

## Sheet RS485.SchDoc
size 420 x 297 mm; Revision: 1.1.0; SheetNumber: 9; SheetTotal: 15
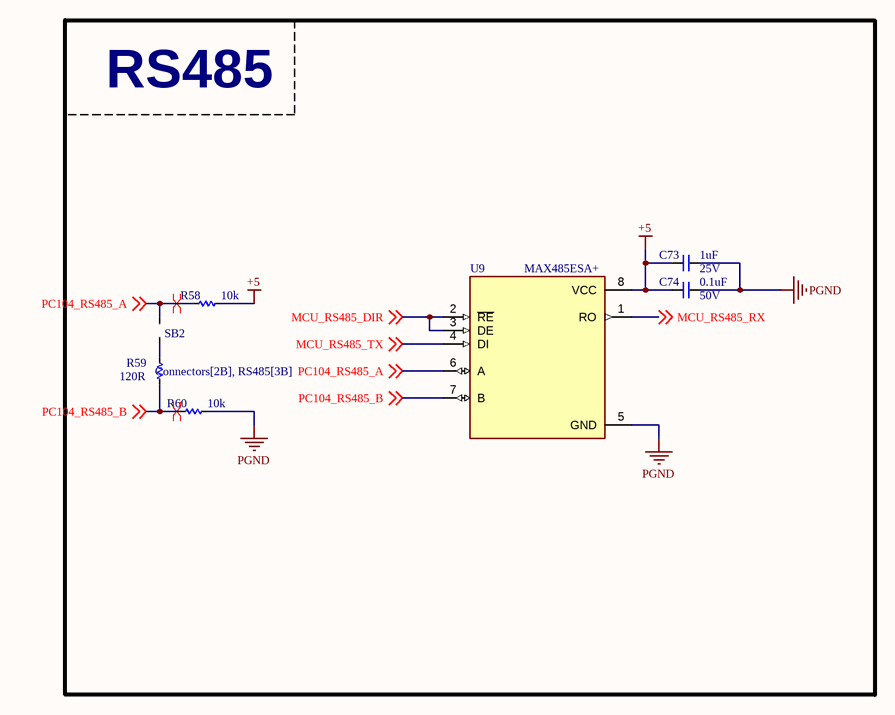
[diagram p9: RS485.SchDoc]

### Parts
C73  1uF  Voltage: 25V  [CAP_C_1608X80]
C74  0.1uF  Voltage: 50V  [CAP_C_1608X80]
R58  10k  [RES_C_1608X60]
R59  120R  [RES_C_1608X60]
R60  10k  [RES_C_1608X60]
SB2  N/A  [JUMPER_1608]  (value not drawn)
U9  MAX485ESA+  [SOIC127]

### Blocks framed on the sheet
RS485: C73 C74 R58-R60 SB2 U9

### Nets
+5: C73.2 C74.2 R58.2 U9.8(VCC)
PGND: C73.1 C74.1 R60.2 U9.5(GND)
MCU_RS485_DIR: U9.2(~{RE}) U9.3(DE) ; off-sheet MCU_RS485_DIR
MCU_RS485_RX: U9.1(RO) ; off-sheet MCU_RS485_RX
MCU_RS485_TX: U9.4(DI) ; off-sheet MCU_RS485_TX
PC104_RS485_A: R58.1 SB2.2 U9.6(A) ; off-sheet PC104_RS485_A
PC104_RS485_B: R59.1 R60.1 U9.7(B) ; off-sheet PC104_RS485_B
NetR59_2: R59.2 SB2.1

### Layout directives
differential pair: PC104_RS485_A, PC104_RS485_B

### Notes on the sheet
- Project:
- DAL_PDU
- Sub-system:
- IGRVT-50
- Design by:
- KIEN HOANG
- BAO BUI
- Sheet title:
- Sheet
- A3
- of
- Checked by:
- Approved by:
- VU PHAM
- Revision:
- Document No:
- Size:
- Date:

### Library data of the parts
C73 C74 = _CAP_C_2: CAP
R58-R60 = _RES_B_2_2: RES
SB2 = JUMPER

## Sheet TemperatureSensor.SchDoc
size 420 x 297 mm; SheetNumber: 10; SheetTotal: 15
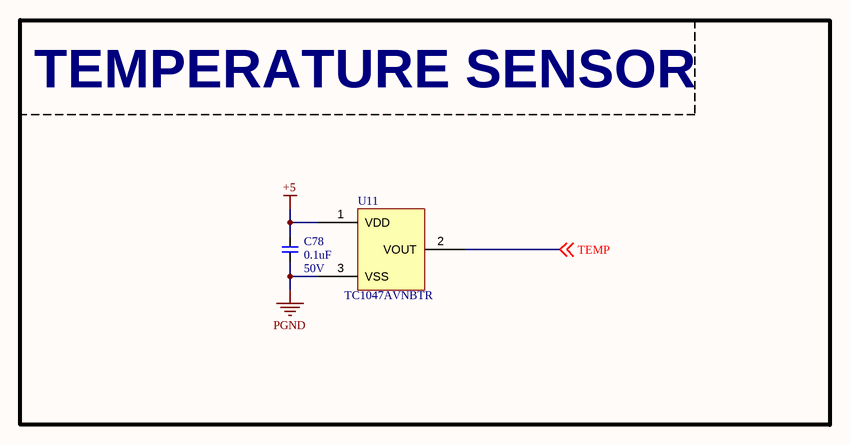
[diagram p10: TemperatureSensor.SchDoc]

### Parts
C78  0.1uF  Voltage: 50V  [CAP_C_1608X80]
U11  TC1047AVNBTR  [SOT-23]

### Blocks framed on the sheet
TEMPERATURE SENSOR: C78 U11

### Nets
+5: C78.1 U11.1(VDD)
PGND: C78.2 U11.3(VSS)
TEMP: U11.2(VOUT) ; off-sheet TEMP

### Notes on the sheet
- Project:
- DAL_PDU
- Sub-system:
- IGRVT-50
- Design by:
- KIEN HOANG
- BAO BUI
- Sheet title:
- Sheet
- A3
- of
- Checked by:
- Approved by:
- VU PHAM
- Revision:
- Document No:
- Size:
- Date:

### Library data of the parts
C78 = _CAP_C_2: CAP

## Sheet RS232.SchDoc
size 420 x 297 mm; Revision: 1.1.0; SheetNumber: 11; SheetTotal: 15
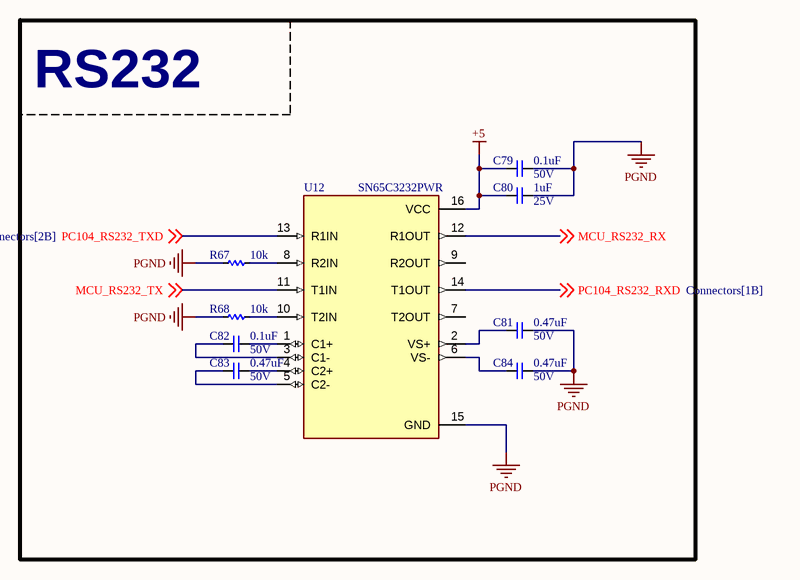
[diagram p11: RS232.SchDoc]

### Parts
C79  0.1uF  Voltage: 50V  [CAP_C_1608X80]
C80  1uF  Voltage: 25V  [CAP_C_1608X80]
C81  0.47uF  Voltage: 50V  [CAP_C_1608X80]
C82  0.1uF  Voltage: 50V  [CAP_C_1608X80]
C83  0.47uF  Voltage: 50V  [CAP_C_1608X80]
C84  0.47uF  Voltage: 50V  [CAP_C_1608X80]
R67  10k  [RES_C_1608X60]
R68  10k  [RES_C_1608X60]
U12  SN65C3232PWR  [TSSOP-16]

### Blocks framed on the sheet
RS232: C79-C84 R67 R68 U12

### Nets
+5: C79.2 C80.2 U12.16(VCC)
PGND: C79.1 C80.1 C81.1 C84.1 R67.1 R68.1 U12.15(GND)
MCU_RS232_RX: U12.12(R1OUT) ; off-sheet MCU_RS232_RX
MCU_RS232_TX: U12.11(T1IN) ; off-sheet MCU_RS232_TX
PC104_RS232_RXD: U12.14(T1OUT) ; off-sheet PC104_RS232_RXD
PC104_RS232_TXD: U12.13(R1IN) ; off-sheet PC104_RS232_TXD
NetC81_2: C81.2 U12.2(VS+)
NetC82_1: C82.1 U12.1(C1+)
NetC82_2: C82.2 U12.3(C1-)
NetC83_1: C83.1 U12.4(C2+)
NetC83_2: C83.2 U12.5(C2-)
NetC84_2: C84.2 U12.6(VS-)
NetR67_2: R67.2 U12.8(R2IN)
NetR68_2: R68.2 U12.10(T2IN)

Not connected (* = marked no-connect by the designer): U12 7(T2OUT) 9(R2OUT)

### Notes on the sheet
- Project:
- DAL_PDU
- Sub-system:
- IGRVT-50
- Design by:
- KIEN HOANG
- BAO BUI
- Sheet title:
- Sheet
- A3
- of
- Checked by:
- Approved by:
- VU PHAM
- Revision:
- Document No:
- Size:
- Date:

### Library data of the parts
C79-C84 = _CAP_C_2: CAP
R67 R68 = _RES_B_2_2: RES

## Sheet WatchDog.SchDoc
size 420 x 297 mm; SheetNumber: 12; SheetTotal: 15
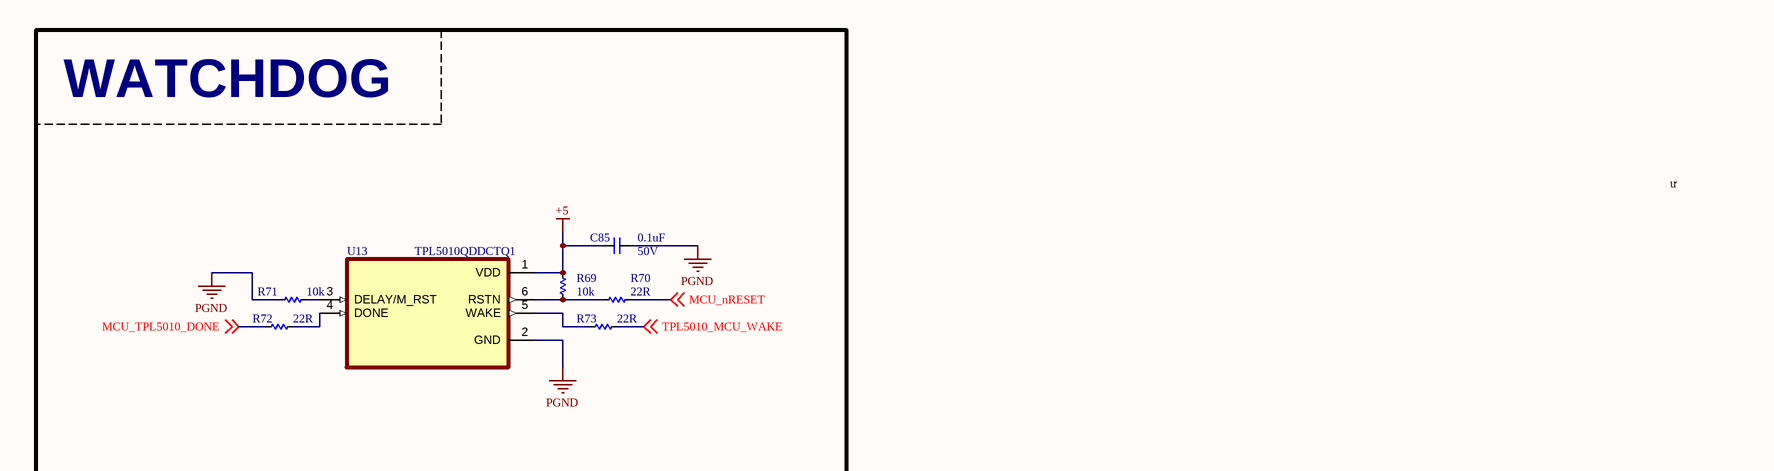
[diagram p12: WatchDog.SchDoc, left]

### Parts
C85  0.1uF  Voltage: 50V  [CAP_C_1608X80]
R69  10k  [RES_C_1608X60]
R70  22R  [RES_C_1608X60]
R71  10k  [RES_C_1608X60]
R72  22R  [RES_C_1608X60]
R73  22R  [RES_C_1608X60]
U13  TPL5010QDDCTQ1  [SOT-23-THN-6]

### Blocks framed on the sheet
WATCHDOG: C85 R69-R73 U13

### Nets
+5: C85.2 R69.2 U13.1(VDD)
PGND: C85.1 R71.1 U13.2(GND)
MCU_nRESET: R70.1 ; off-sheet MCU_nRESET
MCU_TPL5010_DONE: R72.2 ; off-sheet MCU_TPL5010_DONE
TPL5010_MCU_WAKE: R73.1 ; off-sheet TPL5010_MCU_WAKE
NetR69_1: R69.1 R70.2 U13.6(RSTN)
NetR71_2: R71.2 U13.3(DELAY/M_RST)
NetR72_1: R72.1 U13.4(DONE)
NetR73_2: R73.2 U13.5(WAKE)

### Notes on the sheet
- ư
- Project:
- DAL_PDU
- Sub-system:
- IGRVT-50
- Design by:
- KIEN HOANG
- BAO BUI
- Sheet title:
- Sheet
- A3
- of
- Checked by:
- Approved by:
- VU PHAM
- Revision:
- Document No:
- Size:
- Date:

### Library data of the parts
C85 = _CAP_C_2: CAP
R69-R73 = _RES_B_2_2: RES

## Sheet I2C.SchDoc
size A4; SheetNumber: 13; SheetTotal: 15
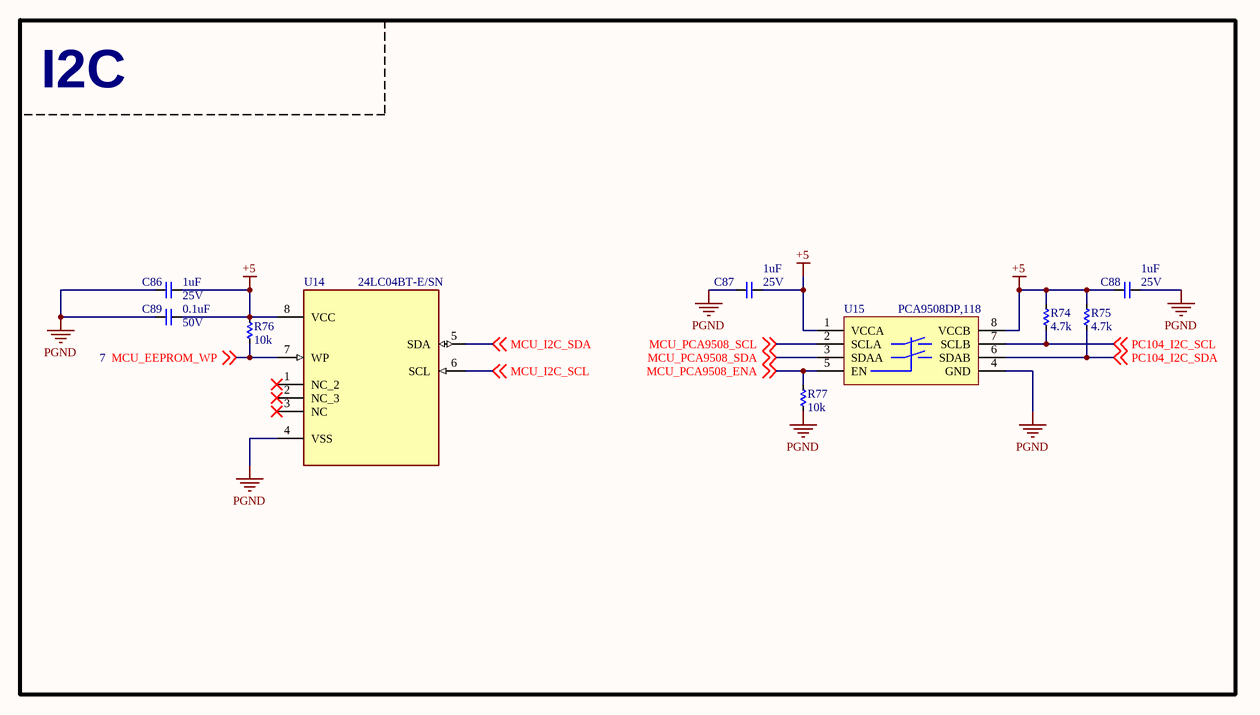
[diagram p13: I2C.SchDoc]

### Parts
C86  1uF  Voltage: 25V  [CAP_C_1608X80]
C87  1uF  Voltage: 25V  [CAP_C_1608X80]
C88  1uF  Voltage: 25V  [CAP_C_1608X80]
C89  0.1uF  Voltage: 50V  [CAP_C_1608X80]
R74  4.7k  [RES_C_1608X60]
R75  4.7k  [RES_C_1608X60]
R76  10k  [RES_C_1608X60]
R77  10k  [RES_C_1608X60]
U14  24LC04BT-E/SN  [SOIC_127]
U15  PCA9508DP,118  [TSOP8]

### Blocks framed on the sheet
I2C: C86-C89 R74-R77 U14 U15

### Nets
+5: C86.1 C87.2 C88.2 C89.1 R74.1 R75.1 R76.1 U14.8(VCC) U15.1(VCCA) U15.8(VCCB)
PGND: C86.2 C87.1 C88.1 C89.2 R77.1 U14.4(VSS) U15.4(GND)
MCU_EEPROM_WP: R76.2 U14.7(WP) ; off-sheet MCU_EEPROM_WP
MCU_I2C_SCL: U14.6(SCL) ; off-sheet MCU_I2C_SCL
MCU_I2C_SDA: U14.5(SDA) ; off-sheet MCU_I2C_SDA
MCU_PCA9508_ENA: R77.2 U15.5(EN) ; off-sheet MCU_PCA9508_ENA
MCU_PCA9508_SCL: U15.2(SCLA) ; off-sheet MCU_PCA9508_SCL
MCU_PCA9508_SDA: U15.3(SDAA) ; off-sheet MCU_PCA9508_SDA
PC104_I2C_SCL: R74.2 U15.7(SCLB) ; off-sheet PC104_I2C_SCL
PC104_I2C_SDA: R75.2 U15.6(SDAB) ; off-sheet PC104_I2C_SDA

Not connected (* = marked no-connect by the designer): U14 1(NC_2)* 2(NC_3)* 3(NC)*

### Library data of the parts
C86-C89 = _CAP_C_2: CAP
R74-R77 = _RES_B_2_2: RES

## Sheet LED.SchDoc
size 420 x 297 mm; Revision: 1.1.0; SheetNumber: 14; SheetTotal: 15
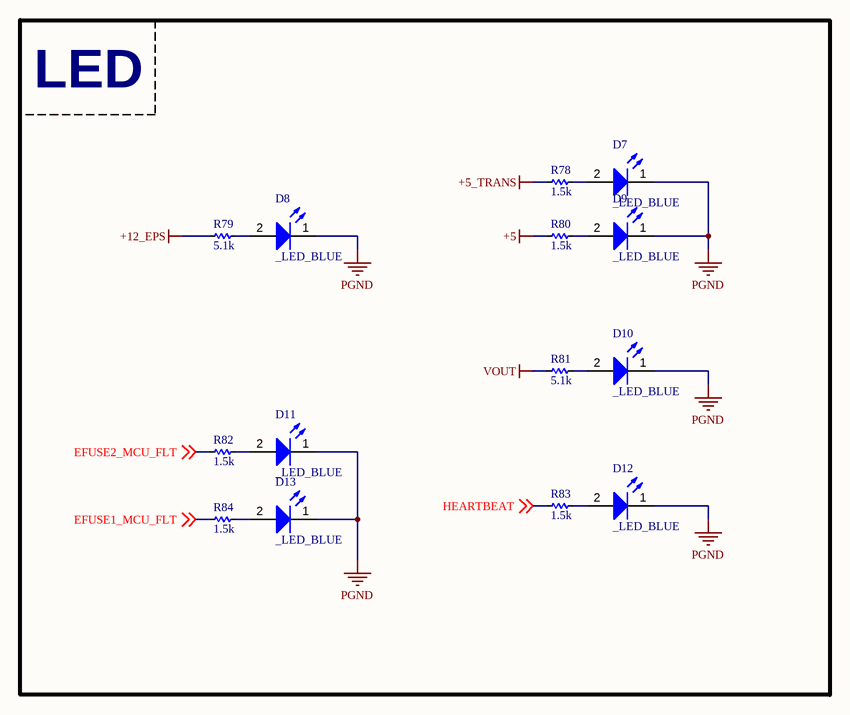
[diagram p14: LED.SchDoc]

### Parts
D7  _LED_BLUE  [LED_0603]
D8  _LED_BLUE  [LED_0603]
D9  _LED_BLUE  [LED_0603]
D10  _LED_BLUE  [LED_0603]
D11  _LED_BLUE  [LED_0603]
D12  _LED_BLUE  [LED_0603]
D13  _LED_BLUE  [LED_0603]
R78  1.5k  [RES_C_1608X60]
R79  5.1k  [RES_C_1608X60]
R80  1.5k  [RES_C_1608X60]
R81  5.1k  [RES_C_1608X60]
R82  1.5k  [RES_C_1608X60]
R83  1.5k  [RES_C_1608X60]
R84  1.5k  [RES_C_1608X60]

### Blocks framed on the sheet
LED: D7-D13 R78-R84

### Nets
+5: R80.2
+5_TRANS: R78.2
+12_EPS: R79.2
PGND: D7.1(K) D8.1(K) D9.1(K) D10.1(K) D11.1(K) D12.1(K) D13.1(K)
VOUT: R81.2
EFUSE1_MCU_FLT: R84.2 ; off-sheet EFUSE1_MCU_FLT
EFUSE2_MCU_FLT: R82.2 ; off-sheet EFUSE2_MCU_FLT
HEARTBEAT: R83.2 ; off-sheet HEARTBEAT
NetD7_2: D7.2(A) R78.1
NetD8_2: D8.2(A) R79.1
NetD9_2: D9.2(A) R80.1
NetD10_2: D10.2(A) R81.1
NetD11_2: D11.2(A) R82.1
NetD12_2: D12.2(A) R83.1
NetD13_2: D13.2(A) R84.1

### Notes on the sheet
- Project:
- DAL_PDU
- Sub-system:
- IGRVT-50
- Design by:
- KIEN HOANG
- BAO BUI
- Sheet title:
- Sheet
- A3
- of
- Checked by:
- Approved by:
- VU PHAM
- Revision:
- Document No:
- Size:
- Date:

### Library data of the parts
R78-R84 = _RES_B_2_2: RES

## Sheet Mounting Holes.SchDoc
size 420 x 297 mm; Revision: 1.1.0; SheetNumber: 15; SheetTotal: 15
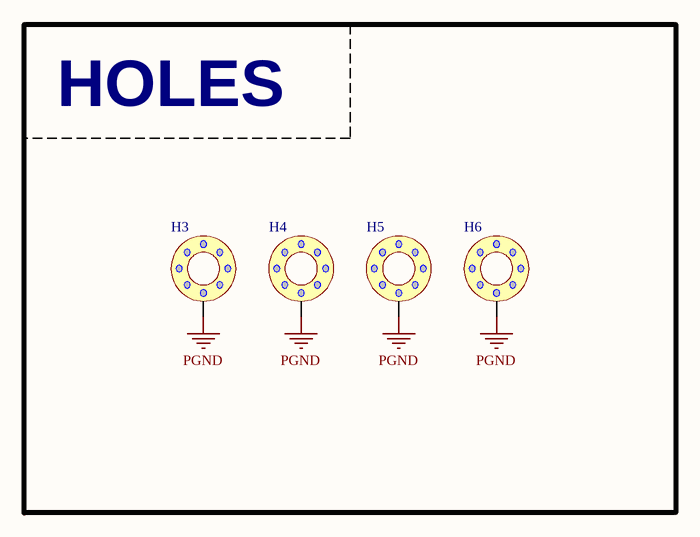
[diagram p15: Mounting Holes.SchDoc]

### Parts
H3  Shield  [HEX-M3]  (value not drawn)
H4  Shield  [HEX-M3]  (value not drawn)
H5  Shield  [HEX-M3]  (value not drawn)
H6  Shield  [HEX-M3]  (value not drawn)

### Blocks framed on the sheet
HOLES: H3-H6

### Nets
PGND: H3.1 H4.1 H5.1 H6.1

### Notes on the sheet
- Project:
- DAL_PDU
- Sub-system:
- IGRVT-50
- Design by:
- KIEN HOANG
- BAO BUI
- Sheet title:
- Sheet
- A3
- of
- Checked by:
- Approved by:
- VU PHAM
- Revision:
- Document No:
- Size:
- Date:

## Nets that join several sheets
+5: Connectors (7 pins), PowerMonitor (8 pins), eFuse (R4.1 R6.1), MCU (12 pins), CAN (9 pins), RS485 (C73.2 C74.2 R58.2 U9.8), TemperatureSensor (C78.1 U11.1), RS232 (C79.2 C80.2 U12.16), WatchDog (C85.2 R69.2 U13.1), I2C (10 pins), LED (R80.2)
+5_SENSE: PowerMonitor (R66.1), Buck 5V (8 pins)
+5_SENSE_TRANS: PowerMonitor (R64.1), Buck 5V (8 pins)
+5_TRANS: Connectors (10 pins), PowerMonitor (R64.2), LED (R78.2)
+12: PowerMonitor (R62.2), eFuse (10 pins)
+12_EPS: Connectors (6 pins), PowerMonitor (R62.1), LED (R79.2)
+12_MCU: eFuse (C3.2 C4.1 D2.1 U2.6), Buck 5V (C27.1 C28.1 U4.2 U4.3)
+12_TRANS: eFuse (C1.2 C2.1 D1.1 U1.6), Buck 5V (C25.1 C26.1 U3.2 U3.3), Buck 5-12V (7 pins)
PGND: Connectors (37 pins), PowerMonitor (6 pins), eFuse (24 pins), Buck 5V (24 pins), Buck 5-12V (17 pins), MCU (18 pins), CAN (11 pins), RS485 (C73.1 C74.1 R60.2 U9.5), TemperatureSensor (C78.2 U11.3), RS232 (7 pins), WatchDog (C85.1 R71.1 U13.2), I2C (7 pins), LED (7 pins), Mounting Holes (H3.1 H4.1 H5.1 H6.1)
VOUT: Connectors (10 pins), PowerMonitor (R61.2), LED (R81.2)
VOUT_SENSE: PowerMonitor (R61.1), Buck 5-12V (6 pins)
CAN_H: Connectors (H1.03), CAN (R57.1 U8.7)
CAN_L: Connectors (H1.01), CAN (SB1.1 U8.6)
EFUSE1_MCU_FLT: eFuse (R4.2 U1.4), MCU (U6.39), LED (R84.2)
EFUSE2_MCU_FLT: eFuse (R6.2 U2.4), MCU (U6.35), LED (R82.2)
HEARTBEAT: MCU (U6.48), LED (R83.2)
MCU_CONSOLE_RX: Connectors (P1#2.2), MCU (R38.2)
MCU_CONSOLE_TX: Connectors (P1#2.3), MCU (R36.2)
MCU_EEPROM_WP: MCU (U6.51), I2C (R76.2 U14.7)
MCU_EFUSE_EN: eFuse (Q1.1 R11.1), MCU (U6.37)
MCU_I2C_SCL: PowerMonitor (U10.4), Buck 5-12V (U5.3), MCU (R44.2 R50.2), I2C (U14.6)
MCU_I2C_SDA: PowerMonitor (U10.5), Buck 5-12V (U5.4), MCU (R45.2 R49.2), I2C (U14.5)
MCU_MCP2515_CS: MCU (R35.1), CAN (R55.2 U7.16)
MCU_MCP2515_INT: MCU (R42.1), CAN (R54.2 U7.12)
MCU_nRESET: Connectors (J1.6), MCU (C66.2 R48.2 SW1.2 U6.20), WatchDog (R70.1)
MCU_PAC1934_INT: PowerMonitor (R63.2 U10.1), MCU (U6.41)
MCU_PCA9508_ENA: MCU (U6.49), I2C (R77.2 U15.5)
MCU_PCA9508_SCL: MCU (R43.2 R52.2), I2C (U15.2)
MCU_PCA9508_SDA: MCU (R41.2 R51.2), I2C (U15.3)
MCU_PIO_IRQ2: Connectors (H1.45), MCU (U6.46)
MCU_RS232_RX: MCU (R33.2), RS232 (U12.12)
MCU_RS232_TX: MCU (R34.2), RS232 (U12.11)
MCU_RS485_DIR: MCU (U6.30), RS485 (U9.2 U9.3)
MCU_RS485_RX: MCU (R46.2), RS485 (U9.1)
MCU_RS485_TX: MCU (R47.2), RS485 (U9.4)
MCU_SPI_MISO: MCU (R40.1), CAN (U7.15)
MCU_SPI_MOSI: MCU (R39.1), CAN (U7.14)
MCU_SPI_SCK: MCU (R37.1), CAN (U7.13)
MCU_TCK: Connectors (R86.1), MCU (U6.57)
MCU_TDI: Connectors (R87.1), MCU (U6.54)
MCU_TDO: Connectors (R85.2), MCU (U6.55)
MCU_TMS: Connectors (R88.1), MCU (U6.56)
MCU_TPL5010_DONE: MCU (U6.16), WatchDog (R72.2)
PC104_RS232_RXD: Connectors (H1.19), RS232 (U12.14)
PC104_RS232_TXD: Connectors (H1.20), RS232 (U12.13)
PC104_RS485_A: Connectors (H1.38), RS485 (R58.1 SB2.2 U9.6)
PC104_RS485_B: Connectors (H1.37), RS485 (R59.1 R60.1 U9.7)
TEMP: MCU (R32.1), TemperatureSensor (U11.2)
TPL5010_MCU_WAKE: MCU (U6.7), WatchDog (R73.1)